# Altium project BTL_HW_V1.0.0.PrjPcb
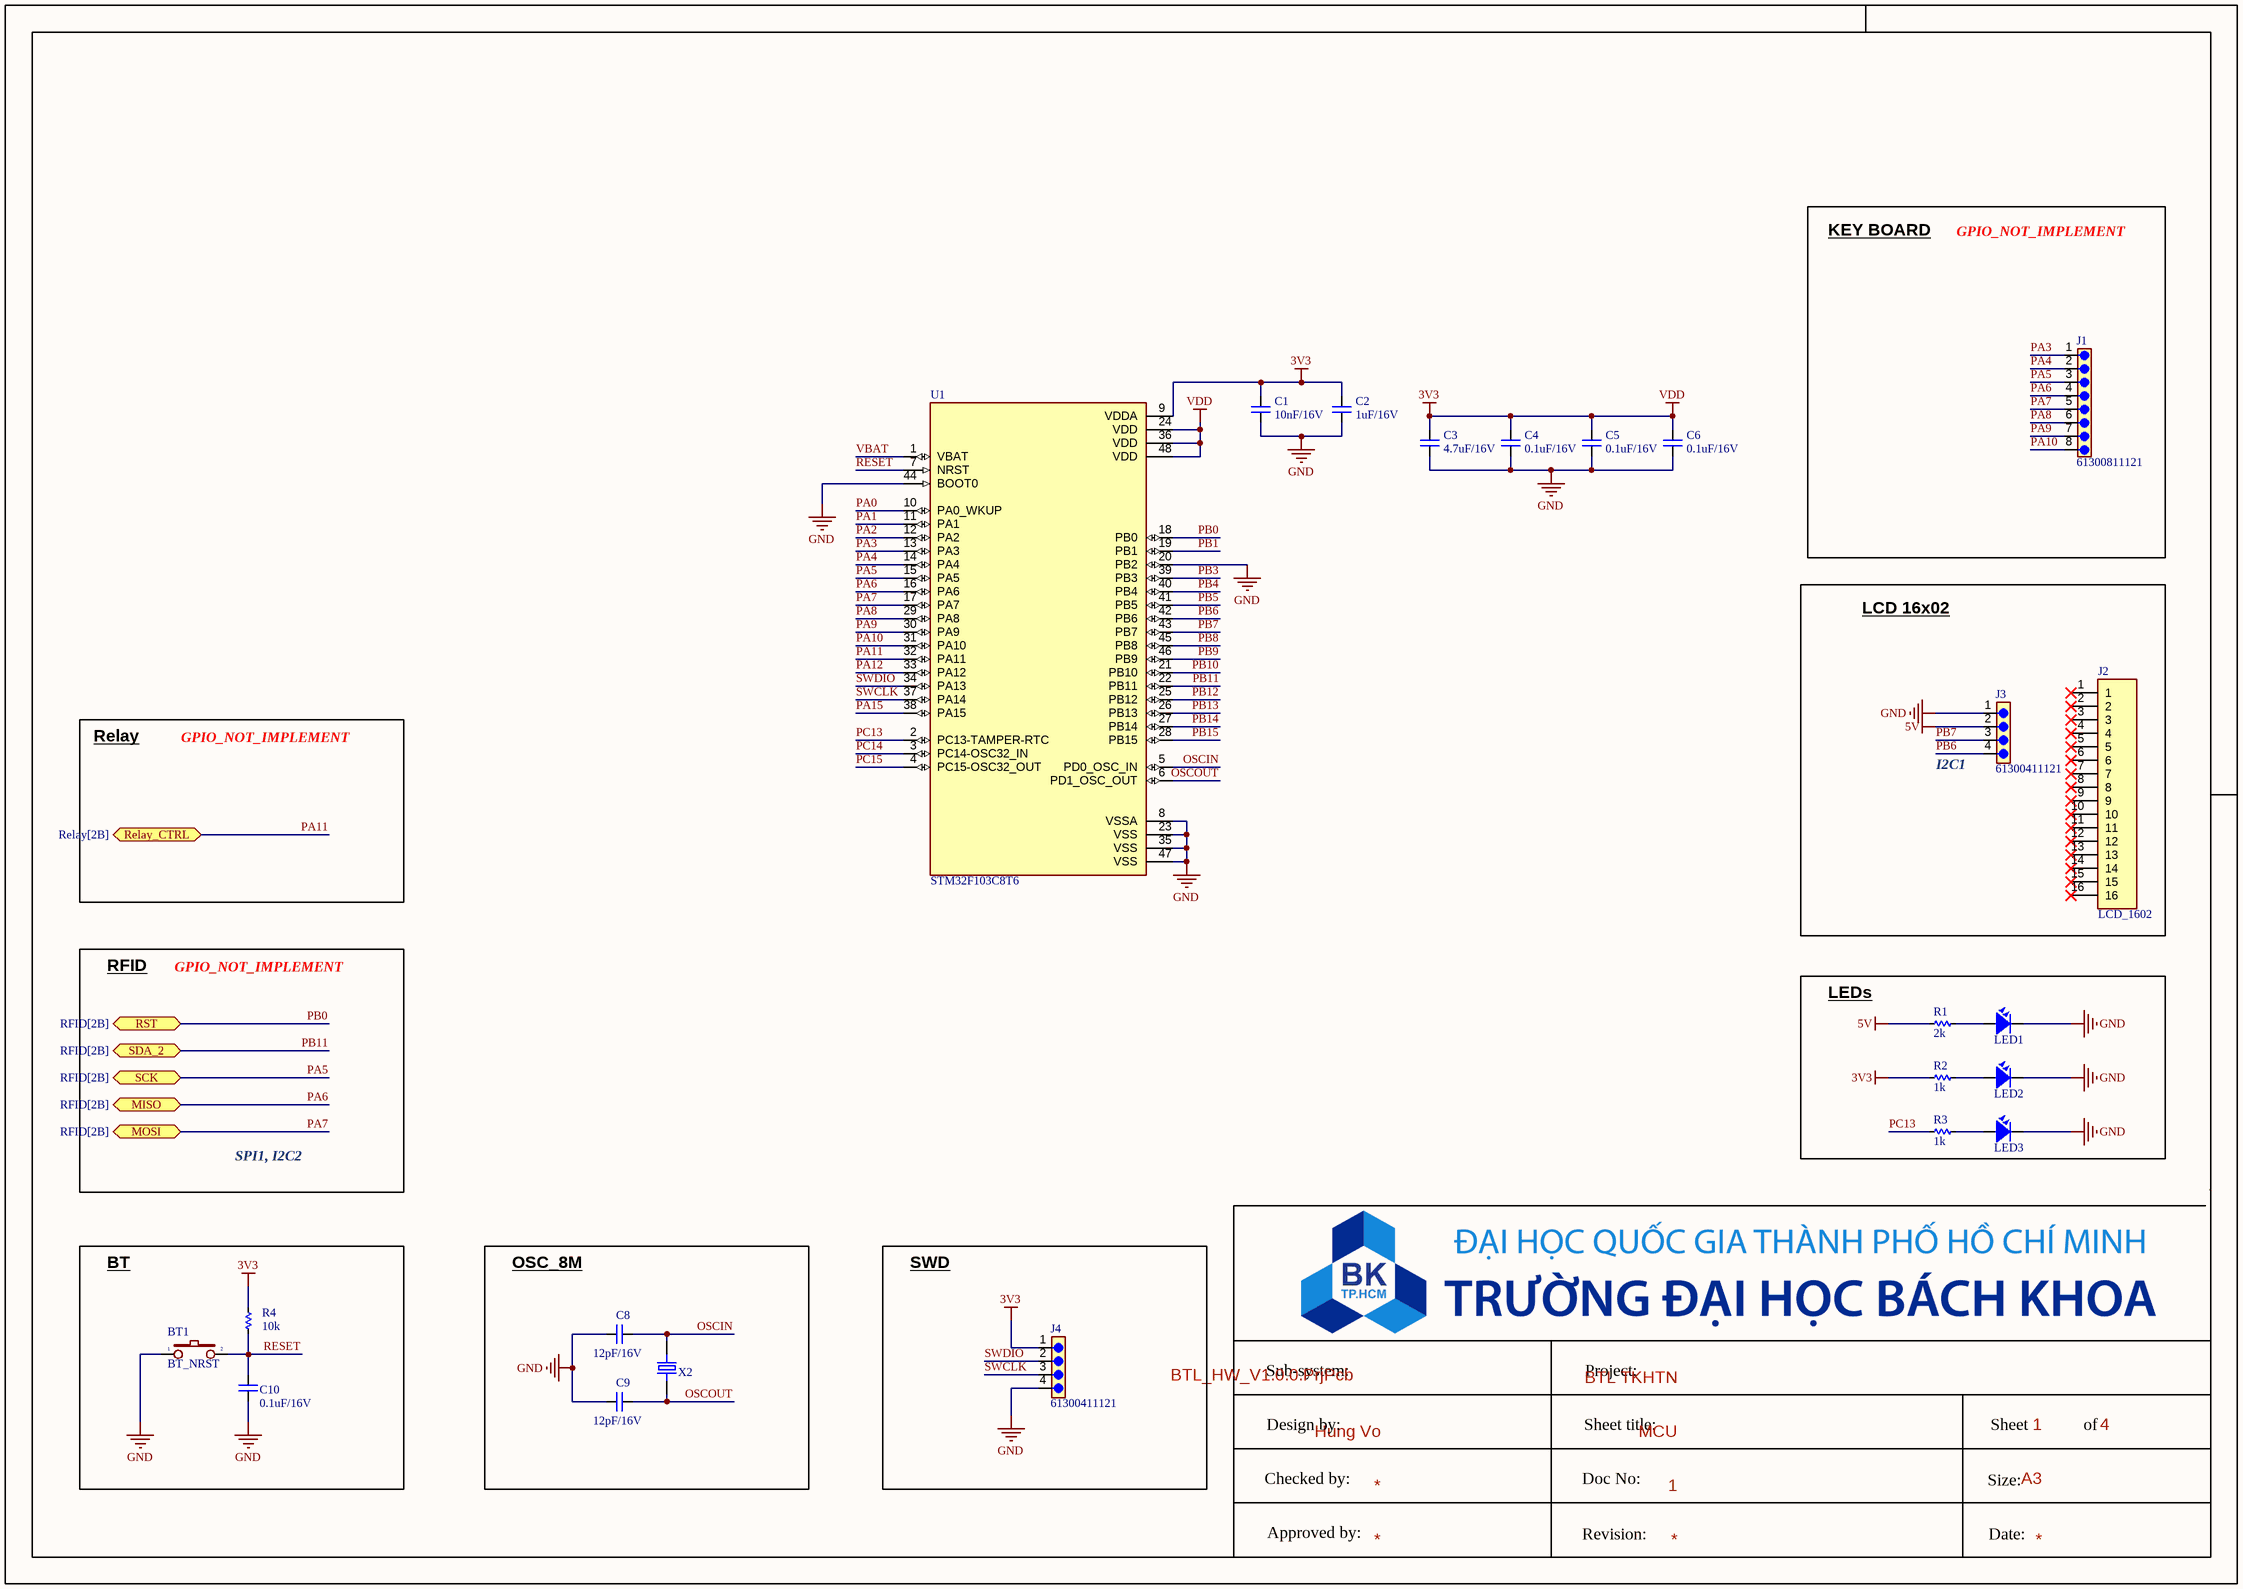
[diagram p0: MCU.SchDoc]
4 sheets, 56 parts. Net scope: flat (ports and power ports of the same name join across sheets).
Sheets:
  MCU.SchDoc
  RFID.SchDoc
  Relay.SchDoc
  POWER.SchDoc

## Sheet MCU.SchDoc: MCU
size 420 x 297 mm; DrawnBy: Hung Vo; SheetNumber: 1; SheetTotal: 4; MasterProject: BTL TKHTN

### Parts
BT1  BT_NRST  [SW2-SMD]
C1  10nF/16V  [CAP_C_1608X80]
C2  1uF/16V  [CAP_C_1608X80]
C3  4.7uF/16V  [CAP_C_1608X80]
C4  0.1uF/16V  [CAP_C_1608X80]
C5  0.1uF/16V  [CAP_C_1608X80]
C6  0.1uF/16V  [CAP_C_1608X80]
C8  12pF/16V  [CAP_C_1608X80]
C9  12pF/16V  [CAP_C_1608X80]
C10  0.1uF/16V  [CAP_C_1608X80]
J1  61300811121  [61300811121]
J2  LCD_1602  [LCD_1602]
J3  61300411121  [61300411121]
J4  61300411121  [61300411121]
LED1  LED  [LED-0603-RED]  (value not drawn)
LED2  LED  [LED-0603-RED]  (value not drawn)
LED3  LED  [LED-0603-RED]  (value not drawn)
R1  2k  [RES_C_1608X60]
R2  1k  [RES_C_1608X60]
R3  1k  [RES_C_1608X60]
R4  10k  [RES_C_1608X60]
U1  STM32F103C8T6  [QFP50P900X900X160-48N]
X2  ECS-080-18-5PX-JES-TR  [XTAL 8MHz]  (value not drawn)

### Blocks framed on the sheet
KEY BOARD: J1
LCD 16x02: J2 J3
LEDs: LED1-LED3 R1-R3
BT: BT1 C10 R4
OSC_8M: C8 C9 X2
SWD: J4

### Ports
MISO (bidir, see RFID[2B]), MOSI (bidir, see RFID[2B]), Relay_CTRL (bidir, see Relay[2B]), RST (bidir, see RFID[2B]), SCK (bidir, see RFID[2B]), SDA_2 (bidir, see RFID[2B])

### Nets
3V3: C1.2 C2.2 C3.2 C4.2 C5.2 C6.2 J4.1 R2.2 R4.2 U1.9(VDDA) U1.24(VDD) U1.36(VDD) U1.48(VDD)  [also labelled VDD]
5V: J3.2 R1.2
GND: BT1.1 C1.1 C2.1 C3.1 C4.1 C5.1 C6.1 C8.1 C9.1 C10.1 J3.1 J4.4 LED1.2 LED2.2 LED3.2 U1.8(VSSA) U1.20(PB2) U1.23(VSS) U1.35(VSS) U1.44(BOOT0) U1.47(VSS)
OSCIN: C8.2 U1.5(PD0_OSC_IN) X2.1
OSCOUT: C9.2 U1.6(PD1_OSC_OUT) X2.2
PA0: U1.10(PA0_WKUP)
PA1: U1.11(PA1)
PA2: U1.12(PA2)
PA3: J1.1 U1.13(PA3)
PA4: J1.2 U1.14(PA4)
PA5: J1.3 U1.15(PA5) ; port SCK
PA6: J1.4 U1.16(PA6) ; port MISO
PA7: J1.5 U1.17(PA7) ; port MOSI
PA8: J1.6 U1.29(PA8)
PA9: J1.7 U1.30(PA9)
PA10: J1.8 U1.31(PA10)
PA11: U1.32(PA11) ; port Relay_CTRL
PA12: U1.33(PA12)
PA15: U1.38(PA15)
PB0: U1.18(PB0) ; port RST
PB1: U1.19(PB1)
PB3: U1.39(PB3)
PB4: U1.40(PB4)
PB5: U1.41(PB5)
PB6: J3.4 U1.42(PB6)
PB7: J3.3 U1.43(PB7)
PB8: U1.45(PB8)
PB9: U1.46(PB9)
PB10: U1.21(PB10)
PB11: U1.22(PB11) ; port SDA_2
PB12: U1.25(PB12)
PB13: U1.26(PB13)
PB14: U1.27(PB14)
PB15: U1.28(PB15)
PC13: R3.2 U1.2(PC13-TAMPER-RTC)
PC14: U1.3(PC14-OSC32_IN)
PC15: U1.4(PC15-OSC32_OUT)
RESET: BT1.2 C10.2 R4.1 U1.7(NRST)
SWCLK: J4.3 U1.37(PA14)
SWDIO: J4.2 U1.34(PA13)
VBAT: U1.1(VBAT)
NetLED1_1: LED1.1 R1.1
NetLED2_1: LED2.1 R2.1
NetLED3_1: LED3.1 R3.1

Not connected (* = marked no-connect by the designer): J2 1* 2* 3* 4* 5* 6* 7* 8* 9* 10* 11* 12* 13* 14* 15* 16*

### Notes on the sheet
- GPIO_NOT_IMPLEMENT
- Relay
- (near J3) I2C1
- RFID
- SPI1, I2C2
- Sub-system:
- Project:
- Design by:
- Sheet title:
- Sheet
- of
- Checked by:
- Approved by:
- Doc No:
- Revision:
- Size:
- Date:
- A3

### Library data of the parts
BT1 = BT2: Switch button 2 pin; Value: SW chip 2 pin
C1-C6 C8-C10 = CAP_SMD: CAP_Chip; Value: 33pF
J1 = 61300811121: 8 pins, 1 row, straight, gold plating; MF: Wurth Electronics; SnapEDA_Link: https://www.snapeda.com/parts/61300811121/Wurth+Electronics/view-part/?ref=snap; Package: None; Value: *; MP: 61300811121; Check_prices: https://www.snapeda.com/parts/61300811121/Wurth+Electronics/view-part/?ref=eda
J3 J4 = 61300411121: CONN HEADER VERT 4POS 2.54MM; MF: WÃ¼rth Elektronik; SnapEDA_Link: https://www.snapeda.com/parts/61300411121/W%25C3%25BCrth+Elektronik+Midcom/view-part/?ref=snap; Package: None; Value: *; MP: 61300411121; Check_prices: https://www.snapeda.com/parts/61300411121/W%25C3%25BCrth+Elektronik+Midcom/view-part/?ref=eda
LED1-LED3 = LED SMD: Value: LED 3 - 5 ly 2 Colour
R1-R4 = RES_SMD: RES
U1 = STM32F103C8T6: ARM® Cortex®-M3 STM32F1 Microcontroller IC 32-Bit 72MHz 64KB (64K x 8) FLASH 48-LQFP (7x7); MF: STMicroelectronics; SnapEDA_Link: https://www.snapeda.com/parts/STM32F103C8T6/STMicroelectronics/view-part/?ref=snap; Package: LQFP-48 STMicroelectronics; Value: *; MP: STM32F103C8T6; Check_prices: https://www.snapeda.com/parts/STM32F103C8T6/STMicroelectronics/view-part/?ref=eda
X2 = ECS-080-18-5PX-JES-TR: 8 MHz Â±20ppm Crystal 18pF 60 Ohms HC-49/US; MF: ECS Inc.; SnapEDA_Link: https://www.snapeda.com/parts/ECS-080-18-5PX-JES-TR/ECS/view-part/?ref=snap; Package: CSM-7X-3L-5G3X-2 ECS; Value: *; MP: ECS-080-18-5PX-JES-TR; Check_prices: https://www.snapeda.com/parts/ECS-080-18-5PX-JES-TR/ECS/view-part/?ref=eda

## Sheet RFID.SchDoc: RFID
size 420 x 297 mm; DrawnBy: Hung Vo; SheetNumber: 2; SheetTotal: 4; MasterProject: BTL TKHTN
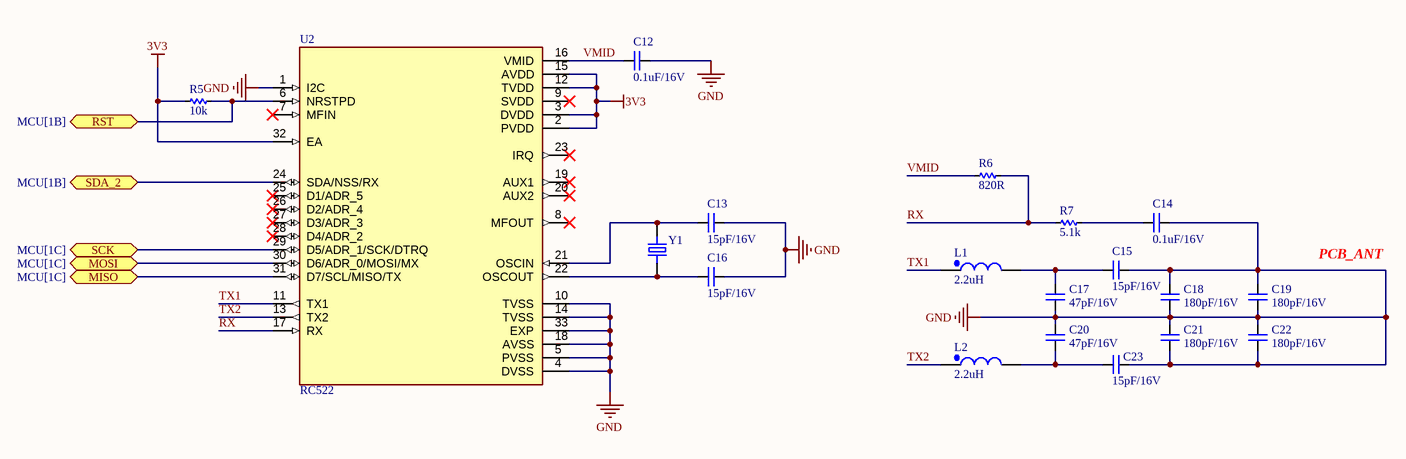
[diagram p1: RFID.SchDoc]

### Parts
C12  0.1uF/16V  [CAP_C_1608X80]
C13  15pF/16V  [CAP_C_1608X80]
C14  0.1uF/16V  [CAP_C_1608X80]
C15  15pF/16V  [CAP_C_1608X80]
C16  15pF/16V  [CAP_C_1608X80]
C17  47pF/16V  [CAP_C_1608X80]
C18  180pF/16V  [CAP_C_1608X80]
C19  180pF/16V  [CAP_C_1608X80]
C20  47pF/16V  [CAP_C_1608X80]
C21  180pF/16V  [CAP_C_1608X80]
C22  180pF/16V  [CAP_C_1608X80]
C23  15pF/16V  [CAP_C_1608X80]
L1  2.2uH  [IND_C_2012X65]
L2  2.2uH  [IND_C_2012X65]
R5  10k  [RES_C_1608X60]
R6  820R  [RES_C_1608X60]
R7  5.1k  [RES_C_1608X60]
U2  RC522  [QFN50P500X500X100-33N]
Y1  C1E-27.120-4-3030-R  [XTAL_C1E-27.120-4-3030-R]  (value not drawn)

### Ports
MISO (bidir, see MCU[1C]), MOSI (bidir, see MCU[1C]), RST (bidir, see MCU[1B]), SCK (bidir, see MCU[1C]), SDA_2 (bidir, see MCU[1B])

### Nets
3V3: R5.1 U2.2(PVDD) U2.3(DVDD) U2.12(TVDD) U2.15(AVDD) U2.32(EA)
GND: C12.2 C13.2 C14.2 C15.2 C16.2 C17.1 C18.1 C18.2 C19.1 C19.2 C20.2 C21.1 C21.2 C22.1 C22.2 C23.2 U2.1(I2C) U2.4(DVSS) U2.5(PVSS) U2.10(TVSS) U2.14(TVSS) U2.18(AVSS) U2.33(EXP)
PA5: U2.29(D5/ADR_1/SCK/DTRQ) ; port SCK
PA6: U2.31(D7/SCL/MISO/TX) ; port MISO
PA7: U2.30(D6/ADR_0/MOSI/MX) ; port MOSI
PB0: R5.2 U2.6(NRSTPD) ; port RST
PB11: U2.24(SDA/NSS/RX) ; port SDA_2
RX: R6.2 R7.1 U2.17(RX)
TX1: L1.1 U2.11(TX1)
TX2: L2.1 U2.13(TX2)
VMID: C12.1 R6.1 U2.16(VMID)
NetC13_1: C13.1 U2.21(OSCIN) Y1.3
NetC14_1: C14.1 R7.2
NetC15_1: C15.1 C17.2 L1.2
NetC16_1: C16.1 U2.22(OSCOUT) Y1.1
NetC20_1: C20.1 C23.1 L2.2

Not connected (* = marked no-connect by the designer): U2 7(MFIN)* 8(MFOUT)* 9(SVDD)* 19(AUX1)* 20(AUX2)* 23(IRQ)* 25(D1/ADR_5)* 26(D2/ADR_4)* 27(D3/ADR_3)* 28(D4/ADR_2)*

### Notes on the sheet
- PCB_ANT
- Sub-system:
- Project:
- Design by:
- Sheet title:
- Sheet
- of
- Checked by:
- Approved by:
- Doc No:
- Revision:
- Size:
- Date:
- A3

### Library data of the parts
C12-C23 = CAP_SMD: CAP_Chip; Value: 33pF
L1 L2 = _IND
R5-R7 = RES_SMD: RES
U2 = RC522: IC RFID READER 13.56MHZ 32HVQFN; MF: NXP USA Inc.; SnapEDA_Link: https://www.snapeda.com/parts/RC522/NXP+Semiconductors/view-part/?ref=snap; Package: VFQFN-32 NXP Semiconductors; Value: *; MP: RC522; Check_prices: https://www.snapeda.com/parts/RC522/NXP+Semiconductors/view-part/?ref=eda
Y1 = C1E-27.120-4-3030-R: CRYSTAL 27.1200MHZ 8PF SMD; Package: None; Price: None; Value: *; MP: C1E-27.120-4-3030-R; Availability: Unavailable

## Sheet Relay.SchDoc: RELAY
size 420 x 297 mm; DrawnBy: Hung Vo; SheetNumber: 3; SheetTotal: 4; MasterProject: BTL TKHTN
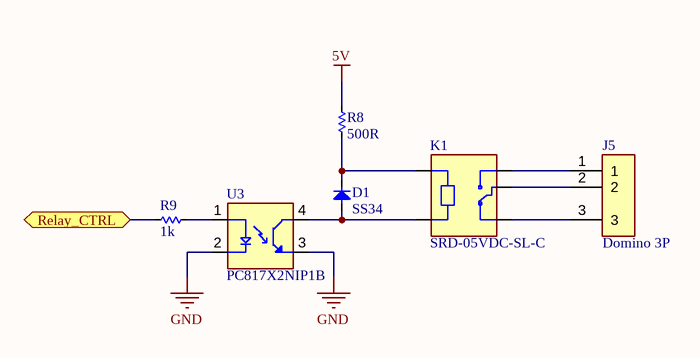
[diagram p2: Relay.SchDoc]

### Parts
D1  SS34  [DO-214AC_SMA]
J5  Domino 3P  [Terminal Domino 3P]
K1  SRD-05VDC-SL-C  [RELAY_SRD-05VDC-SL-C]
R8  500R  [RES_C_1608X60]
R9  1k  [RES_C_1608X60]
U3  PC817X2NIP1B  [SOIC254P960X420-4N]

### Ports
Relay_CTRL (bidir, see MCU[1B])

### Nets
5V: R8.2
GND: U3.2(C) U3.3(ET)
PA11: R9.1 ; port Relay_CTRL
NetD1_1: D1.1(K) K1.A1 R8.1
NetD1_2: D1.2(A) K1.A2 U3.4(CT)
NetJ5_1: J5.1 K1.NO
NetJ5_2: J5.2 K1.COM
NetJ5_3: J5.3 K1.NC
NetR9_2: R9.2 U3.1(A)

### Notes on the sheet
- Sub-system:
- Project:
- Design by:
- Sheet title:
- Sheet
- of
- Checked by:
- Approved by:
- Doc No:
- Revision:
- Size:
- Date:
- A3

### Library data of the parts
D1 = Diode SMD: Default Diode; Code - JEDEC: DO-214-AB; Value: 1N5007; Published: 8-Jun-2000; Revision: July-2002: Re-released for DXP Platform.; Publisher: Altium Limited
K1 = SRD-05VDC-SL-C: 5V Trigger Relay Module For Arduino And Raspberry Pi 5V Trigger Relay Module For Arduino And Raspberry Pi; MF: Songle Relay; Check_prices: https://www.snapeda.com/parts/SRD-05VDC-SL-C/Songle+Relay/view-part/?ref=eda; Value: *; Availability: Not in stock; Price: None; Package: NON STANDARD-5 Songle Relay; MP: SRD-05VDC-SL-C; SnapEDA_Link: https://www.snapeda.com/parts/SRD-05VDC-SL-C/Songle+Relay/view-part/?ref=snap
R8 R9 = RES_SMD: RES
U3 = PC817X2NIP1B: Optocoupler DC-IN 1-CH Transistor DC-OUT 4-Pin DIP SMD T/R; MF: Sharp Microelectronics; SnapEDA_Link: https://www.snapeda.com/parts/PC817X2NIP1B/Sharp+Microelectronics/view-part/?ref=snap; Package: SMD-4 Sharp Microelectronics; Value: *; MP: PC817X2NIP1B; Check_prices: https://www.snapeda.com/parts/PC817X2NIP1B/Sharp+Microelectronics/view-part/?ref=eda

## Sheet POWER.SchDoc: POWER
size 420 x 297 mm; DrawnBy: Hung Vo; SheetNumber: 4; SheetTotal: 4; MasterProject: BTL TKHTN
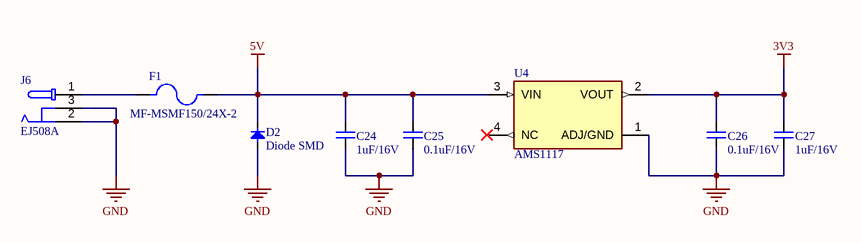
[diagram p3: POWER.SchDoc]

### Parts
C24  1uF/16V  [CAP_C_1608X80]
C25  0.1uF/16V  [CAP_C_1608X80]
C26  0.1uF/16V  [CAP_C_1608X80]
C27  1uF/16V  [CAP_C_1608X80]
D2  Diode SMD  [DO-214AC_SMA]
F1  MF-MSMF150/24X-2  [FUSER_MF-MSMF150/24X-2]
J6  EJ508A  [MPD_EJ508A]
U4  AMS1117  [SOT229P700X180-4N]

### Nets
3V3: C26.2 C27.2 U4.2(VOUT)
5V: C24.2 C25.2 D2.1(K) F1.2 U4.3(VIN)
GND: C24.1 C25.1 C26.1 C27.1 D2.2(A) J6.2 J6.3 U4.1(ADJ/GND)
NetF1_1: F1.1 J6.1

Not connected (* = marked no-connect by the designer): U4 4(NC)*

### Notes on the sheet
- Sub-system:
- Project:
- Design by:
- Sheet title:
- Sheet
- of
- Checked by:
- Approved by:
- Doc No:
- Revision:
- Size:
- Date:
- A3

### Library data of the parts
C24-C27 = CAP_SMD: CAP_Chip; Value: 33pF
D2 = Diode SMD: as D1 on sheet Relay; Published: 8-Jun-2000; Revision: July-2002: Re-released for DXP Platform.; Publisher: Altium Limited
F1 = MF-MSMF150/24X-2: Polymeric PTC Resettable Fuse 24V 1.5 A Ih Surface Mount 1812 (4532 Metric), Concave; MF: Bourns; Check_prices: https://www.snapeda.com/parts/MF-MSMF150/24X-2/Bourns/view-part/?ref=eda; Value: *; MP: MF-MSMF150/24X-2; Purchase-URL: https://pricing.snapeda.com/search/part/MF-MSMF150/24X-2/?ref=eda; SnapEDA_Link: https://www.snapeda.com/parts/MF-MSMF150/24X-2/Bourns/view-part/?ref=snap; Package: 1812 Bourns; Digi-Key_Part_Number: MF-MSMF150/24X-2TR-ND
J6 = EJ508A: Power Barrel Connector Jack 2.10mm ID _0.083_, 5.50mm OD _0.217_ Through Hole, Right Angle; MF: MPD; Package: Non-Standard MPD; Value: *; SnapEDA_Link: https://www.snapeda.com/parts/EJ508A/MPD%20%28Memory%20Protection%20Devices%29/view-part/474399/?ref=snap; Price: None; MP: EJ508A; Availability: Unavailable
U4 = AMS1117: 1A LOW DROPOUT VOLTAGE REGULATOR SOT-223; MF: Advanced Monolithic Systems; SnapEDA_Link: https://www.snapeda.com/parts/AMS1117/Advanced+Monolithic+Systems/view-part/?ref=snap; Package: SOT-223 Seeed Technology; Value: *; MP: AMS1117; Check_prices: https://www.snapeda.com/parts/AMS1117/Advanced+Monolithic+Systems/view-part/?ref=eda

## Nets that join several sheets
3V3: MCU (13 pins), RFID (6 pins), POWER (C26.2 C27.2 U4.2)
5V: MCU (J3.2 R1.2), Relay (R8.2), POWER (5 pins)
GND: MCU (21 pins), RFID (23 pins), Relay (U3.2 U3.3), POWER (8 pins)
PA5: MCU (J1.3 U1.15), RFID (U2.29)
PA6: MCU (J1.4 U1.16), RFID (U2.31)
PA7: MCU (J1.5 U1.17), RFID (U2.30)
PA11: MCU (U1.32), Relay (R9.1)
PB0: MCU (U1.18), RFID (R5.2 U2.6)
PB11: MCU (U1.22), RFID (U2.24)